# Altium schematic sheet AVT5805_SCH_DF.SchDoc
size A4; SheetNumber: 1; SheetTotal: 1
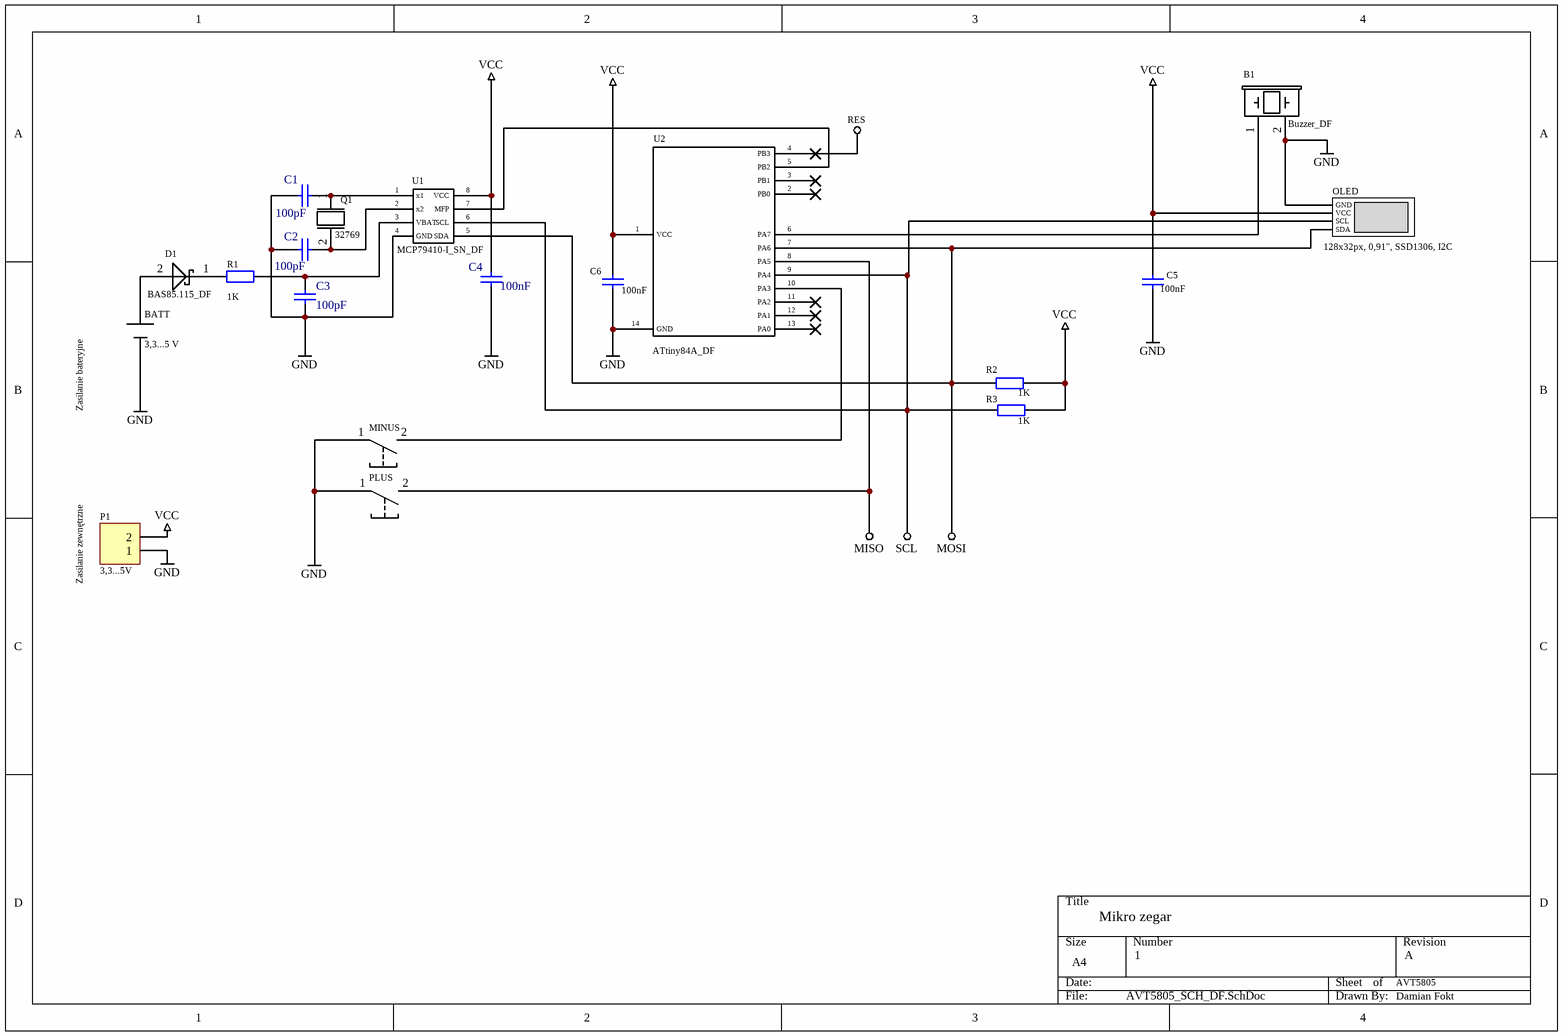
[diagram p0: AVT5805_SCH_DF.SchDoc]

## Parts
32769  Q1  [DT-38]
B1  Buzzer_DF  [LPT9018BS]
BATT  3,3...5 V  [DS1092]
C1  value 100pF  [C1206]  (hidden comment: Cap Semi)
C2  value 100pF  [C1206]  (hidden comment: Cap Semi)
C3  value 100pF  [C1206]  (hidden comment: Cap Semi)
C4  value 100nF  [C1206]  (hidden comment: Cap Semi)
C5  value 100nF  [C1206]  (hidden comment: Cap Semi)
C6  value 100nF  [C1206]  (hidden comment: Cap Semi)
D1  BAS85.115_DF  [MINIMELF]
MINUS  Button_DF  [DTSM31NB]  (value not drawn)
OLED  128x32px, 0,91", SSD1306, I2C  [SSD1306]
P1  3,3...5V  [HDR1X2]
PLUS  Button_DF  [DTSM31NB]  (value not drawn)
R1  value 1K  [RESC6332]  (hidden comment: Res2)
R2  value 1K  [RESC6332]  (hidden comment: Res2)
R3  value 1K  [RESC6332]  (hidden comment: Res2)
U1  MCP79410-I_SN_DF  [SO08]
U2  ATtiny84A_DF  [SOIC14]

## Nets
GND: B1.2 BATT.2(GND) C1.1 C2.1 C3.1 C4.1 C5.1 C6.1 MINUS.1 OLED.1(GND) P1.1 PLUS.1 U1.4(GND) U2.14(GND)
MISO: PLUS.2 U2.8(PA5)
MOSI: OLED.3(SDA) R2.1 U1.5(SDA) U2.7(PA6)
RES: U2.4(PB3)
SCL: OLED.4(SCL) R3.1 U1.6(SCL) U2.9(PA4)
VCC: C4.2 C5.2 C6.2 OLED.2(VCC) P1.2 R2.2 R3.2 U1.8(VCC) U2.1(VCC)
Net32769_1: 32769.1 C1.2 U1.1(x1)
Net32769_2: 32769.2 C2.2 U1.2(x2)
NetB1_1: B1.1 U2.6(PA7)
NetBATT_1: BATT.1(VCC) D1.2
NetC3_2: C3.2 R1.2 U1.3(VBAT)
NetD1_1: D1.1 R1.1
NetMINUS_2: MINUS.2 U2.10(PA3)
NetU1_7: U1.7(MFP) U2.5(PB2)

Not connected (* = marked no-connect by the designer): U2 2(PB0)* 3(PB1)* 11(PA2)* 12(PA1)* 13(PA0)*

## Notes on the sheet
- Zasilanie bateryjne
- Zasilanie zewnętrzne
- Mikro zegar
- 1
- AVT5805
- A
- Damian Fokt

## Library data of the parts
32769 = Quartz_resonator_DF
BATT = Battery_Socket_DF
C1-C6 = Cap Semi: Capacitor (Semiconductor SIM Model); Published: 8-Jun-2000; LatestRevisionDate: 29-May-2009; LatestRevisionNote: IPC-7351 Footprint Added.; PackageReference: C1206; Publisher: Altium Limited; PackageDescription: Chip Capacitor
OLED = OLED_Screen_DF
P1 = Header 2: Header, 2-Pin; LatestRevisionDate: 17-Jul-2002; LatestRevisionNote: Re-released for DXP Platform.; Publisher: Altium Limited
R1-R3 = Res2: Resistor; Published: 8-Jun-2000; LatestRevisionDate: 17-Jul-2002; LatestRevisionNote: Re-released for DXP Platform.; PackageReference: AXIAL-0.4; Publisher: Altium Limited; PackageDescription: Axial Device, Thru-Hole; 2 Leads; 0.4 in Pin Spacing